# EAGLE schematic SDDD-PulseBoard-1.0 (EAGLE 7.6.0)

## Sheet 1 of 2
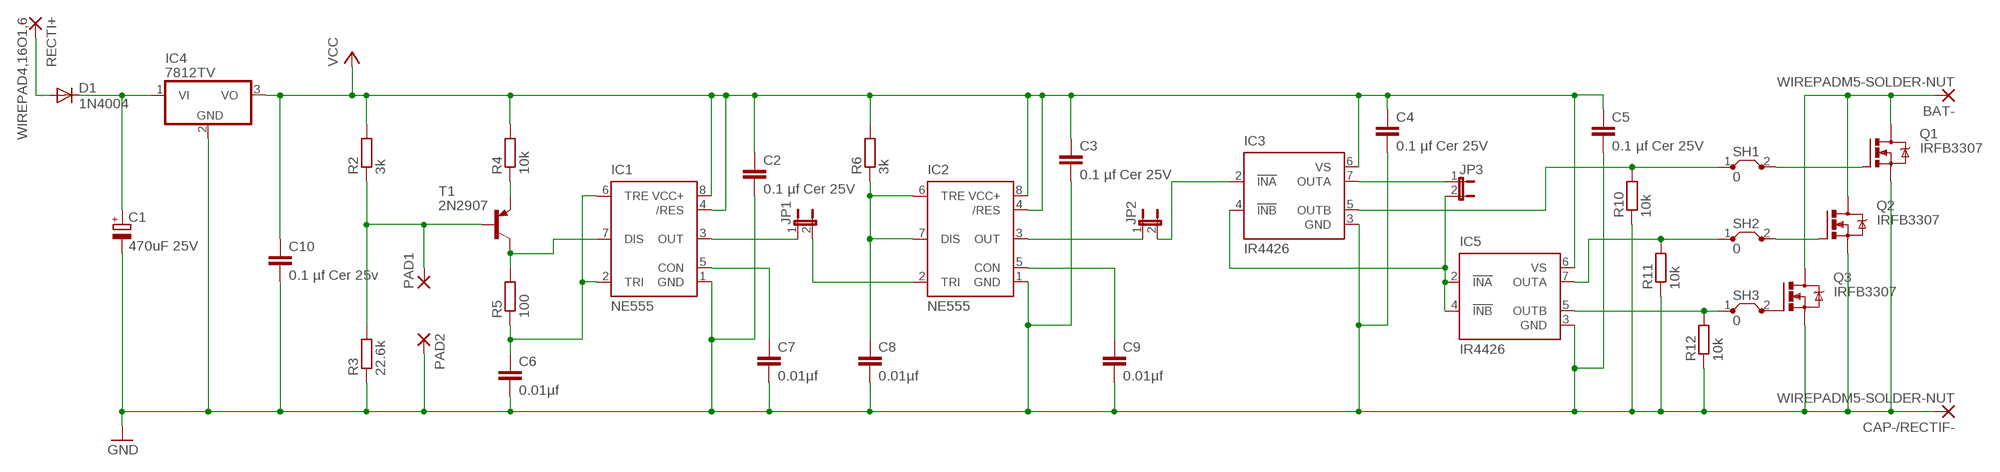
[diagram p0: schematic, sheet 1]

### Parts
BAT-  WIREPADM5-SOLDER-NUT  [M5-SOLDER-NUT]
C1  470uF 25V  CPOL-EUE5-8.5  [E5-8,5]
C2  0.1 µf Cer 25V  C-EU050-025X075  [C050-025X075]
C3  0.1 µf Cer 25V  C-EU050-025X075  [C050-025X075]
C4  0.1 µf Cer 25V  C-EU050-025X075  [C050-025X075]
C5  0.1 µf Cer 25V  C-EU050-025X075  [C050-025X075]
C6  0.01µf  C-EU050-025X075  [C050-025X075]
C7  0.01µf  C-EU050-025X075  [C050-025X075]
C8  0.01µf  C-EU050-025X075  [C050-025X075]
C9  0.01µf  C-EU050-025X075  [C050-025X075]
C10  0.1 µf Cer 25v  C-EU050-025X075  [C050-025X075]
CAP-/RECTIF-  WIREPADM5-SOLDER-NUT  [M5-SOLDER-NUT]
D1  1N4004  [DO41-10]
IC1  NE555  [DIL-08]
IC2  NE555  [DIL-08]
IC3  IR4426  [DIL08]
IC4  7812TV  [TO220V]
IC5  IR4426  [DIL08]
JP1  JP1E  [JP1]
JP2  JP1E  [JP1]
JP3  JP1E  [JP1]
PAD1  2,15/1,0  [2,15/1,0]
PAD2  2,15/1,0  [2,15/1,0]
Q1  IRFB3307  IRF540  [TO220BV]
Q2  IRFB3307  IRF540  [TO220BV]
Q3  IRFB3307  IRF540  [TO220BV]
R2  3k  R-EU_0207/10  [0207/10]
R3  22.6k  R-EU_0207/10  [0207/10]
R4  10k  R-EU_0207/10  [0207/10]
R5  100  R-EU_0207/10  [0207/10]
R6  3k  R-EU_0207/10  [0207/10]
R10  10k  R-EU_0207/10  [0207/10]
R11  10k  R-EU_0207/10  [0207/10]
R12  10k  R-EU_0207/10  [0207/10]
RECTI+  WIREPAD4,16O1,6  [4,16O1,6]
SH1  0  J30MM  [30]
SH2  0  J30MM  [30]
SH3  0  J30MM  [30]
T1  2N2907  MPS2907A-PNP-TO92-CBE  [TO92-CBE]

### Nets
GND: C1.- C2.2 C3.2 C4.2 C5.2 C6.2 C7.2 C8.2 C9.2 C10.2 CAP-/RECTIF-.1(P) CAP-/RECTIF-.P$1(P) CAP-/RECTIF-.P$2(P) CAP-/RECTIF-.P$3(P) CAP-/RECTIF-.P$4(P) CAP-/RECTIF-.P$5(P) CAP-/RECTIF-.P$6(P) CAP-/RECTIF-.P$7(P) CAP-/RECTIF-.P$8(P) CAP-/RECTIF-.P$9(P) CAP-/RECTIF-.P$10(P) CAP-/RECTIF-.P$11(P) CAP-/RECTIF-.P$12(P) CAP-/RECTIF-.P$13(P) CAP-/RECTIF-.P$14(P) CAP-/RECTIF-.P$15(P) CAP-/RECTIF-.P$16(P) CAP-/RECTIF-.P$17(P) CAP-/RECTIF-.P$18(P) CAP-/RECTIF-.P$19(P) CAP-/RECTIF-.P$20(P) CAP-/RECTIF-.P$21(P) CAP-/RECTIF-.P$22(P) CAP-/RECTIF-.P$23(P) CAP-/RECTIF-.P$24(P) CAP-/RECTIF-.P$25(P) CAP-/RECTIF-.P$26(P) CAP-/RECTIF-.P$27(P) CAP-/RECTIF-.P$28(P) CAP-/RECTIF-.P$29(P) CAP-/RECTIF-.P$30(P) CAP-/RECTIF-.P$31(P) CAP-/RECTIF-.P$32(P) CAP-/RECTIF-.P$33(P) CAP-/RECTIF-.P$34(P) CAP-/RECTIF-.P$35(P) CAP-/RECTIF-.P$36(P) CAP-/RECTIF-.P$37(P) CAP-/RECTIF-.P$38(P) CAP-/RECTIF-.P$39(P) CAP-/RECTIF-.P$40(P) CAP-/RECTIF-.P$41(P) CAP-/RECTIF-.P$42(P) CAP-/RECTIF-.P$43(P) CAP-/RECTIF-.P$44(P) CAP-/RECTIF-.P$45(P) CAP-/RECTIF-.P$46(P) CAP-/RECTIF-.P$47(P) CAP-/RECTIF-.P$48(P) CAP-/RECTIF-.P$49(P) CAP-/RECTIF-.P$50(P) CAP-/RECTIF-.P$51(P) CAP-/RECTIF-.P$52(P) CAP-/RECTIF-.P$53(P) CAP-/RECTIF-.P$54(P) CAP-/RECTIF-.P$55(P) CAP-/RECTIF-.P$56(P) CAP-/RECTIF-.P$57(P) CAP-/RECTIF-.P$58(P) CAP-/RECTIF-.P$59(P) CAP-/RECTIF-.P$60(P) CAP-/RECTIF-.P$61(P) CAP-/RECTIF-.P$62(P) CAP-/RECTIF-.P$63(P) CAP-/RECTIF-.P$64(P) CAP-/RECTIF-.P$65(P) CAP-/RECTIF-.P$66(P) CAP-/RECTIF-.P$67(P) CAP-/RECTIF-.P$68(P) CAP-/RECTIF-.P$69(P) CAP-/RECTIF-.P$70(P) CAP-/RECTIF-.P$71(P) CAP-/RECTIF-.P$72(P) CAP-/RECTIF-.P$73(P) CAP-/RECTIF-.P$74(P) CAP-/RECTIF-.P$75(P) CAP-/RECTIF-.P$76(P) CAP-/RECTIF-.P$77(P) CAP-/RECTIF-.P$78(P) CAP-/RECTIF-.P$79(P) CAP-/RECTIF-.P$80(P) IC1.1(GND) IC2.1(GND) IC3.3(GND) IC4.2(GND) IC5.3(GND) PAD2.1(P) Q1.S Q2.S Q3.S R3.1 R10.1 R11.1 R12.1
N$1: IC3.5(OUTB) R10.2 SH1.1
N$2: PAD1.1(P) R2.1 R3.2 T1.B
N$3: C6.1 IC1.2(TRI) IC1.6(TRE) R5.1
N$4: Q1.G SH1.2
N$5: BAT-.1(P) BAT-.P$1(P) BAT-.P$2(P) BAT-.P$3(P) BAT-.P$4(P) BAT-.P$5(P) BAT-.P$6(P) BAT-.P$7(P) BAT-.P$8(P) BAT-.P$9(P) BAT-.P$10(P) BAT-.P$11(P) BAT-.P$12(P) BAT-.P$13(P) BAT-.P$14(P) BAT-.P$15(P) BAT-.P$16(P) BAT-.P$17(P) BAT-.P$18(P) BAT-.P$19(P) BAT-.P$20(P) BAT-.P$21(P) BAT-.P$22(P) BAT-.P$23(P) BAT-.P$24(P) BAT-.P$25(P) BAT-.P$26(P) BAT-.P$27(P) BAT-.P$28(P) BAT-.P$29(P) BAT-.P$30(P) BAT-.P$31(P) BAT-.P$32(P) BAT-.P$33(P) BAT-.P$34(P) BAT-.P$35(P) BAT-.P$36(P) BAT-.P$37(P) BAT-.P$38(P) BAT-.P$39(P) BAT-.P$40(P) BAT-.P$41(P) BAT-.P$42(P) BAT-.P$43(P) BAT-.P$44(P) BAT-.P$45(P) BAT-.P$46(P) BAT-.P$47(P) BAT-.P$48(P) BAT-.P$49(P) BAT-.P$50(P) BAT-.P$51(P) BAT-.P$52(P) BAT-.P$53(P) BAT-.P$54(P) BAT-.P$55(P) BAT-.P$56(P) BAT-.P$57(P) BAT-.P$58(P) BAT-.P$59(P) BAT-.P$60(P) BAT-.P$61(P) BAT-.P$62(P) BAT-.P$63(P) BAT-.P$64(P) BAT-.P$65(P) BAT-.P$66(P) BAT-.P$67(P) BAT-.P$68(P) BAT-.P$69(P) BAT-.P$70(P) BAT-.P$71(P) BAT-.P$72(P) BAT-.P$73(P) BAT-.P$74(P) BAT-.P$75(P) BAT-.P$76(P) BAT-.P$77(P) BAT-.P$78(P) BAT-.P$79(P) BAT-.P$80(P) Q1.D Q2.D Q3.D
N$6: IC5.7(OUTA) R11.2 SH2.1
N$7: Q2.G SH2.2
N$8: IC5.5(OUTB) R12.2 SH3.1
N$9: R4.1 T1.E
N$10: IC1.7(DIS) R5.2 T1.C
N$11: Q3.G SH3.2
N$12: C7.1 IC1.5(CON)
N$13: C8.1 IC2.6(TRE) IC2.7(DIS) R6.1
N$14: IC1.3(OUT) JP1.1
N$15: IC2.2(TRI) JP1.2
N$16: IC2.3(OUT) JP2.1
N$17: IC3.2(!INA) JP2.2
N$18: IC3.7(OUTA) JP3.1
N$19: IC3.4(!INB) IC5.2(!INA) IC5.4(!INB) JP3.2
N$20: C1.+ D1.C IC4.1(VI)
N$21: C9.1 IC2.5(CON)
N$22: D1.A RECTI+.1(P)
VCC: C2.1 C3.1 C4.1 C5.1 C10.1 IC1.4(/RES) IC1.8(VCC+) IC2.4(/RES) IC2.8(VCC+) IC3.6(VS) IC4.3(VO) IC5.6(VS) R2.2 R4.2 R6.2

## Sheet 2 of 2

## Library data of the parts
BAT- CAP-/RECTIF- = wirepad-SDDD:WIREPAD: Wire PAD connect wire on PCB
C1 = rcl:CPOL-EU: POLARIZED CAPACITOR, European symbol
C2-C10 = rcl:C-EU: CAPACITOR, European symbol
D1 = diode:1N4004: DIODE general purpose rectifier, 1 A
IC1 IC2 = st-microelectronics:NE555: General purpose bipolar Timer; MF: Arrow Electronics; MPN: NE555N; OC_FARNELL: 1467742; OC_NEWARK: 89K1486
IC3 IC5 = ir:IR4426: DUAL LOW SIDE DRIVER Source: ID4426.pdf; MF: INTERNATIONAL RECTIFIER(IR); MPN: IR4426PBF; OC_FARNELL: 1023265; OC_NEWARK: 19K8460
IC4 = linear:78*: Positive VOLTAGE REGULATOR Source: http://cache.national.com/ds/LM/LM78L05.pdf http://www.fairchildsemi.com/ds/LM/LM7805.pdf
JP1-JP3 = jumper:JP1E: JUMPER
PAD1 PAD2 = wirepad:2,15/1,0: THROUGH-HOLE PAD
Q1-Q3 = transistor-power:IRF540: HEXFET Power MOSFET
R2-R6 R10-R12 = resistor:R-EU_: RESISTOR, European symbol
RECTI+ = wirepad:WIREPAD: Wire PAD connect wire on PCB
SH1-SH3 = jumper:J: Bridge
T1 = transistor:*-PNP-: PNP Transistror